# Altium project EEG_tDCS.PrjPcb
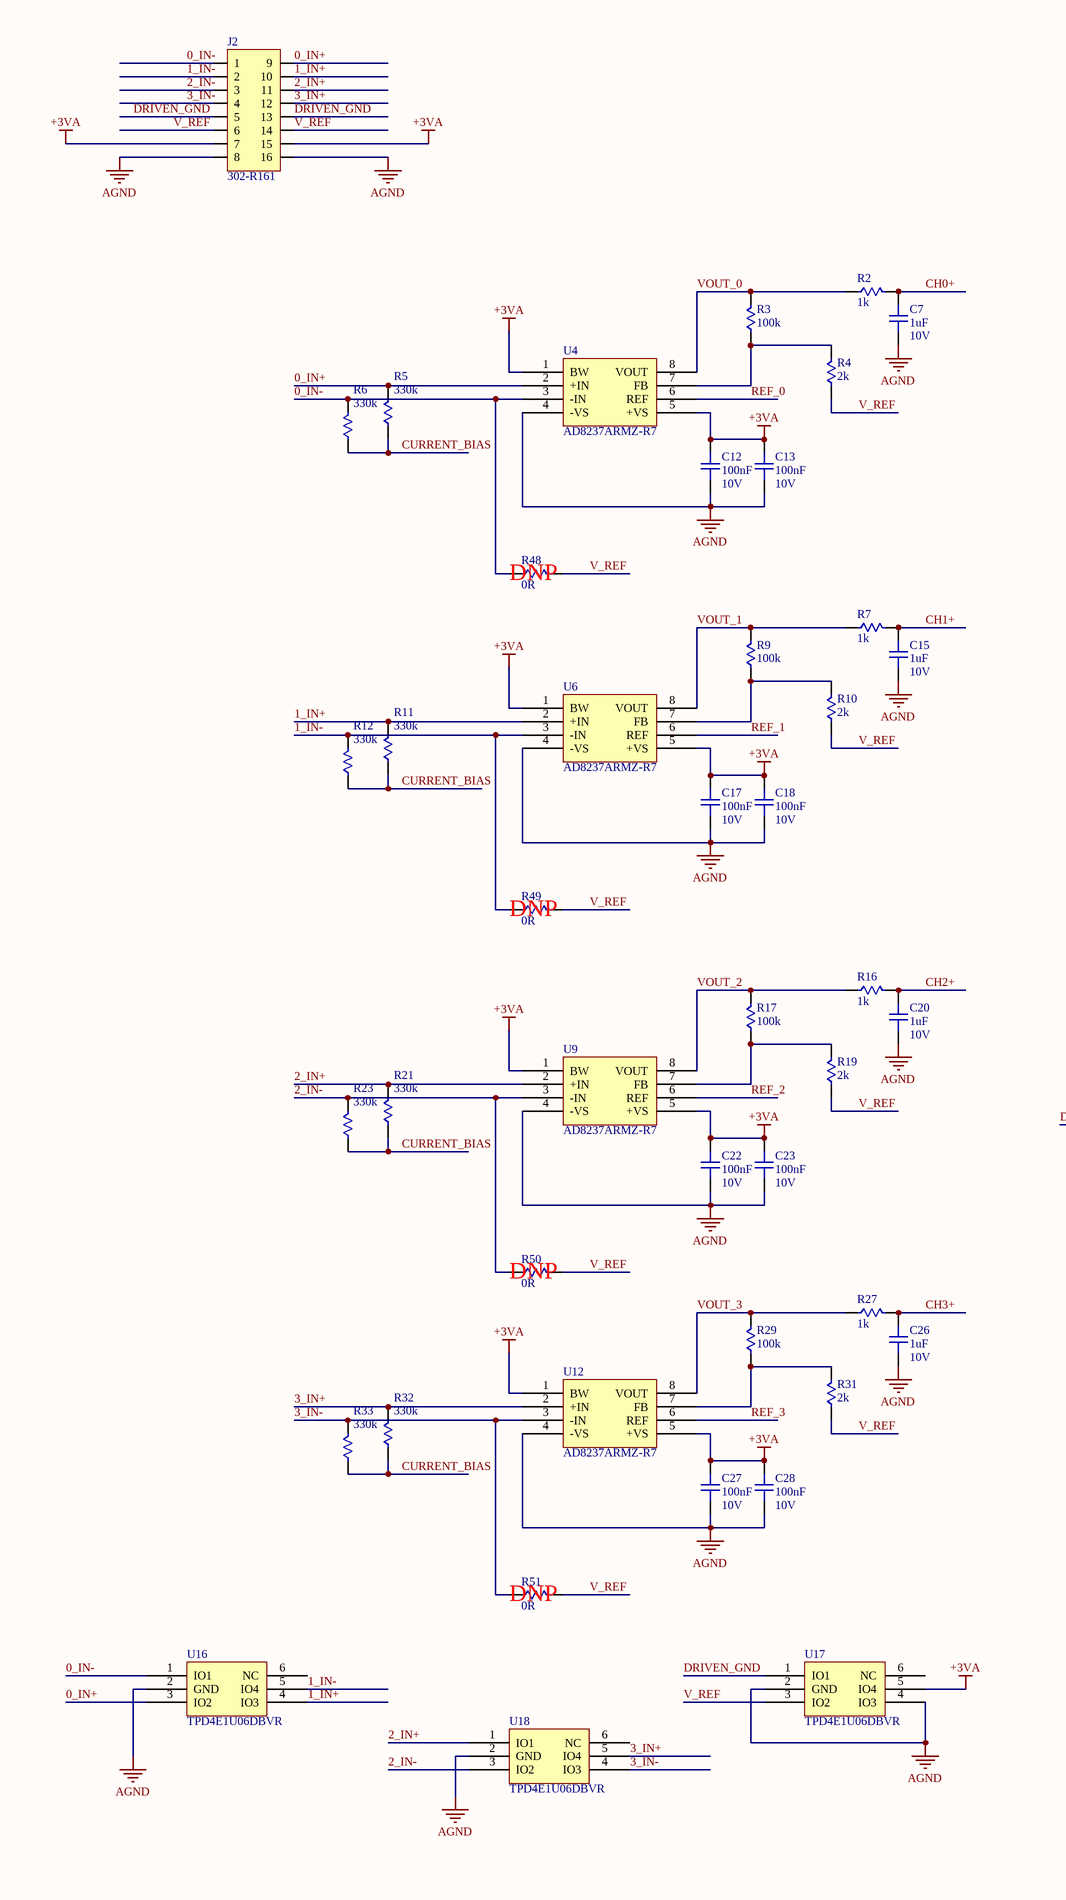
[diagram p0: SENSING.SchDoc, left]
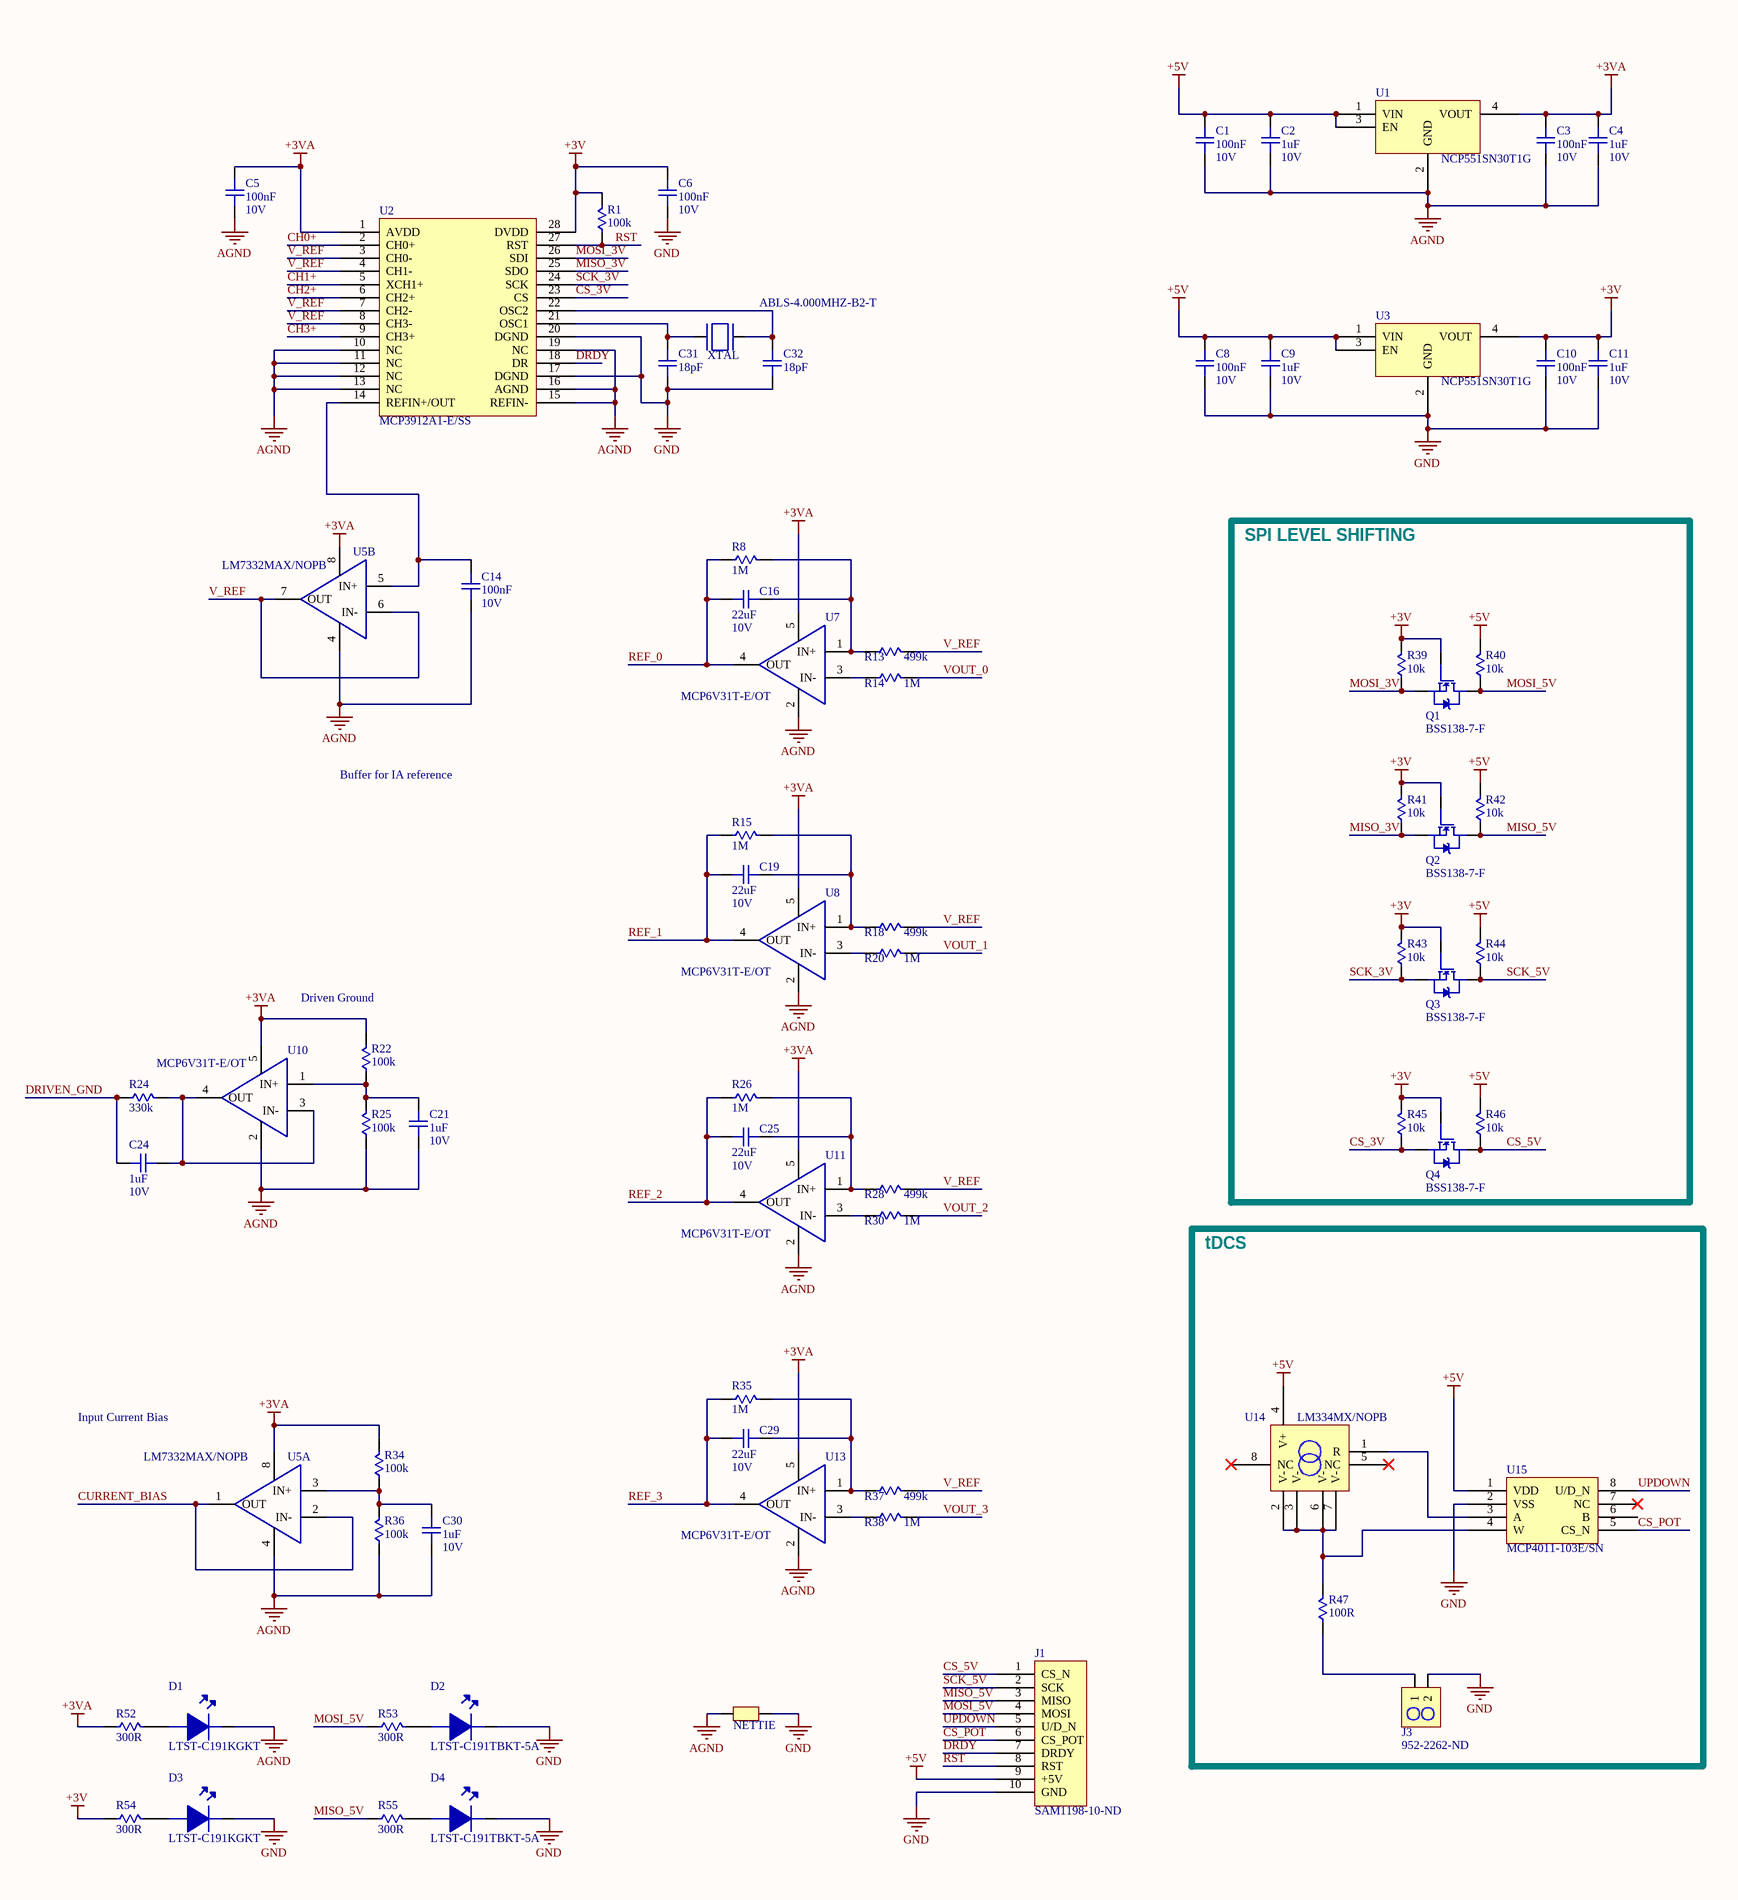
[diagram p1: SENSING.SchDoc, right]
1 sheet, 118 parts. Net scope: global (net labels, ports and power ports of the same name join across sheets).
Board file: EEG_tDCS_PCB.PcbDoc

## Sheet SENSING.SchDoc
size A2

### Parts
C1  100nF  Voltage Rating: 10V  [C0402]
C2  1uF  Voltage Rating: 10V  [C0402]
C3  100nF  Voltage Rating: 10V  [C0402]
C4  1uF  Voltage Rating: 10V  [C0402]
C5  100nF  Voltage Rating: 10V  [C0402]
C6  100nF  Voltage Rating: 10V  [C0402]
C7  1uF  Voltage Rating: 10V  [C0402]
C8  100nF  Voltage Rating: 10V  [C0402]
C9  1uF  Voltage Rating: 10V  [C0402]
C10  100nF  Voltage Rating: 10V  [C0402]
C11  1uF  Voltage Rating: 10V  [C0402]
C12  100nF  Voltage Rating: 10V  [C0402]
C13  100nF  Voltage Rating: 10V  [C0402]
C14  100nF  Voltage Rating: 10V  [C0402]
C15  1uF  Voltage Rating: 10V  [C0402]
C16  22uF  Voltage Rating: 10V  [C0805]
C17  100nF  Voltage Rating: 10V  [C0402]
C18  100nF  Voltage Rating: 10V  [C0402]
C19  22uF  Voltage Rating: 10V  [C0805]
C20  1uF  Voltage Rating: 10V  [C0402]
C21  1uF  Voltage Rating: 10V  [C0402]
C22  100nF  Voltage Rating: 10V  [C0402]
C23  100nF  Voltage Rating: 10V  [C0402]
C24  1uF  Voltage Rating: 10V  [C0402]
C25  22uF  Voltage Rating: 10V  [C0805]
C26  1uF  Voltage Rating: 10V  [C0402]
C27  100nF  Voltage Rating: 10V  [C0402]
C28  100nF  Voltage Rating: 10V  [C0402]
C29  22uF  Voltage Rating: 10V  [C0805]
C30  1uF  Voltage Rating: 10V  [C0402]
C31  18pF  [C0402]
C32  18pF  [C0402]
D1  LTST-C191KGKT  [LED_0603]
D2  LTST-C191TBKT-5A  [LED_0603]
D3  LTST-C191KGKT  [LED_0603]
D4  LTST-C191TBKT-5A  [LED_0603]
J1  SAM1198-10-ND  [Header 10x1 8.5mm]
J2  302-R161  [CONN16POS]
J3  952-2262-ND  [2PIN_HEADER]
Q1  BSS138-7-F  [SOT23-3]
Q2  BSS138-7-F  [SOT23-3]
Q3  BSS138-7-F  [SOT23-3]
Q4  BSS138-7-F  [SOT23-3]
R1  100k  [R0402]
R2  1k  [R0402]
R3  100k  [R0402]
R4  2k  [R0402]
R5  330k  [R0402]
R6  330k  [R0402]
R7  1k  [R0402]
R8  1M  [R0402]
R9  100k  [R0402]
R10  2k  [R0402]
R11  330k  [R0402]
R12  330k  [R0402]
R13  499k  [R0402]
R14  1M  [R0402]
R15  1M  [R0402]
R16  1k  [R0402]
R17  100k  [R0402]
R18  499k  [R0402]
R19  2k  [R0402]
R20  1M  [R0402]
R21  330k  [R0402]
R22  100k  [R0402]
R23  330k  [R0402]
R24  330k  [R0402]
R25  100k  [R0402]
R26  1M  [R0402]
R27  1k  [R0402]
R28  499k  [R0402]
R29  100k  [R0402]
R30  1M  [R0402]
R31  2k  [R0402]
R32  330k  [R0402]
R33  330k  [R0402]
R34  100k  [R0402]
R35  1M  [R0402]
R36  100k  [R0402]
R37  499k  [R0402]
R38  1M  [R0402]
R39  10k  [R0402]
R40  10k  [R0402]
R41  10k  [R0402]
R42  10k  [R0402]
R43  10k  [R0402]
R44  10k  [R0402]
R45  10k  [R0402]
R46  10k  [R0402]
R47  100R  [R0805]
R48  0R  [R0402]
R49  0R  [R0402]
R50  0R  [R0402]
R51  0R  [R0402]
R52  300R  [R0402]
R53  300R  [R0402]
R54  300R  [R0402]
R55  300R  [R0402]
U1  NCP551SN30T1G  [TSOP-5]
U2  MCP3912A1-E/SS  [SSOP-28]
U3  NCP551SN30T1G  [TSOP-5]
U4  AD8237ARMZ-R7  [MSOP-8]
U5  LM7332MAX/NOPB  [8-SOIC]  (parts A,B of 2)
U6  AD8237ARMZ-R7  [MSOP-8]
U7  MCP6V31T-E/OT  [SOT23-5]
U8  MCP6V31T-E/OT  [SOT23-5]
U9  AD8237ARMZ-R7  [MSOP-8]
U10  MCP6V31T-E/OT  [SOT23-5]
U11  MCP6V31T-E/OT  [SOT23-5]
U12  AD8237ARMZ-R7  [MSOP-8]
U13  MCP6V31T-E/OT  [SOT23-5]
U14  LM334MX/NOPB  [8-SOIC]
U15  MCP4011-103E/SN  [8-SOIC]
U16  TPD4E1U06DBVR  [SOT23-6]
U17  TPD4E1U06DBVR  [SOT23-6]
U18  TPD4E1U06DBVR  [SOT23-6]
XTAL  ABLS-4.000MHZ-B2-T  [XTAL]
  NETTIE  [NETTIE]  (net tie, no BOM)

### Blocks framed on the sheet
SPI LEVEL SHIFTING: Q1-Q4 R39-R46
tDCS: J3 R47 U14 U15

### Nets
+3V: C6.2 C10.2 C11.2 Q1.1 Q2.1 Q3.1 Q4.1 R1.2 R39.2 R41.2 R43.2 R45.2 R54.1 U2.28(DVDD) U3.4(VOUT)
+3VA: C3.2 C4.2 C5.2 C12.2 C13.2 C17.2 C18.2 C22.2 C23.2 C27.2 C28.2 J2.7 J2.15 R22.2 R34.2 R52.1 U1.4(VOUT) U2.1(AVDD) U4.1(BW) U4.5(+VS) U5.8(V+) U6.1(BW) U6.5(+VS) U7.5(V+) U8.5(V+) U9.1(BW) U9.5(+VS) U10.5(V+) U11.5(V+) U12.1(BW) U12.5(+VS) U13.5(V+) U17.5(IO4)
+5V: C1.2 C2.2 C8.2 C9.2 J1.9(+5V) R40.2 R42.2 R44.2 R46.2 U1.1(VIN) U1.3(EN) U3.1(VIN) U3.3(EN) U14.4(V+) U15.1(VDD)
AGND: C1.1 C2.1 C3.1 C4.1 C5.1 C7.1 C12.1 C13.1 C14.1 C15.1 C17.1 C18.1 C20.1 C21.1 C22.1 C23.1 C26.1 C27.1 C28.1 C30.1 D1.2 J2.8 J2.16 R25.1 R36.1 U1.2(GND) U2.10(NC) U2.11(NC) U2.12(NC) U2.13(NC) U2.15(REFIN-) U2.16(AGND) U2.19(NC) U4.4(-VS) U5.4(V-) U6.4(-VS) U7.2(V-) U8.2(V-) U9.4(-VS) U10.2(V-) U11.2(V-) U12.4(-VS) U13.2(V-) U16.2(GND) U17.2(GND) U17.4(IO3) U18.2(GND) .1
GND: C6.1 C8.1 C9.1 C10.1 C11.1 C31.1 C32.1 D2.2 D3.2 D4.2 J1.10(GND) J3.2 U2.17(DGND) U2.20(DGND) U3.2(GND) U15.2(VSS) .2
0_IN+: J2.9 R5.2 U4.2(+IN) U16.3(IO2)
0_IN-: J2.1 R6.2 R48.1 U4.3(-IN) U16.1(IO1)
1_IN+: J2.10 R11.2 U6.2(+IN) U16.4(IO3)
1_IN-: J2.2 R12.2 R49.1 U6.3(-IN) U16.5(IO4)
2_IN+: J2.11 R21.2 U9.2(+IN) U18.1(IO1)
2_IN-: J2.3 R23.2 R50.1 U9.3(-IN) U18.3(IO2)
3_IN+: J2.12 R32.2 U12.2(+IN) U18.5(IO4)
3_IN-: J2.4 R33.2 R51.1 U12.3(-IN) U18.4(IO3)
CH0+: C7.2 R2.2 U2.2(CH0+)
CH1+: C15.2 R7.2 U2.5(XCH1+)
CH2+: C20.2 R16.2 U2.6(CH2+)
CH3+: C26.2 R27.2 U2.9(CH3+)
CS_3V: Q4.2 R45.1 U2.23(CS)
CS_5V: J1.1(CS_N) Q4.3 R46.1
CS_POT: J1.6(CS_POT) U15.5(CS_N)
CURRENT_BIAS: R5.1 R6.1 R11.1 R12.1 R21.1 R23.1 R32.1 R33.1 U5.1(OUT) U5.2(IN-)
DRDY: J1.7(DRDY) U2.18(DR)
DRIVEN_GND: C24.2 J2.5 J2.13 R24.1 U17.1(IO1)
MISO_3V: Q2.2 R41.1 U2.25(SDO)
MISO_5V: J1.3(MISO) Q2.3 R42.1 R55.1
MOSI_3V: Q1.2 R39.1 U2.26(SDI)
MOSI_5V: J1.4(MOSI) Q1.3 R40.1 R53.1
REF_0: C16.1 R8.1 U4.6(REF) U7.4(OUT)
REF_1: C19.1 R15.1 U6.6(REF) U8.4(OUT)
REF_2: C25.1 R26.1 U9.6(REF) U11.4(OUT)
REF_3: C29.1 R35.1 U12.6(REF) U13.4(OUT)
RST: J1.8(RST) R1.1 U2.27(RST)
SCK_3V: Q3.2 R43.1 U2.24(SCK)
SCK_5V: J1.2(SCK) Q3.3 R44.1
UPDOWN: J1.5(U/D_N) U15.8(U/D_N)
V_REF: J2.6 J2.14 R4.1 R10.1 R13.2 R18.2 R19.1 R28.2 R31.1 R37.2 R48.2 R49.2 R50.2 R51.2 U2.3(CH0-) U2.4(CH1-) U2.7(CH2-) U2.8(CH3-) U5.6(IN-) U5.7(OUT) U17.3(IO2)
VOUT_0: R2.1 R3.2 R14.2 U4.8(VOUT)
VOUT_1: R7.1 R9.2 R20.2 U6.8(VOUT)
VOUT_2: R16.1 R17.2 R30.2 U9.8(VOUT)
VOUT_3: R27.1 R29.2 R38.2 U12.8(VOUT)
NetC14_2: C14.2 U2.14(REFIN+/OUT) U5.5(IN+)
NetC16_2: C16.2 R8.2 R13.1 U7.1(IN+)
NetC19_2: C19.2 R15.2 R18.1 U8.1(IN+)
NetC21_2: C21.2 R22.1 R25.2 U10.1(IN+)
NetC24_1: C24.1 R24.2 U10.3(IN-) U10.4(OUT)
NetC25_2: C25.2 R26.2 R28.1 U11.1(IN+)
NetC29_2: C29.2 R35.2 R37.1 U13.1(IN+)
NetC30_2: C30.2 R34.1 R36.2 U5.3(IN+)
NetC31_2: C31.2 U2.21(OSC1) XTAL.1
NetC32_2: C32.2 U2.22(OSC2) XTAL.2
NetD1_1: D1.1 R52.2
NetD2_1: D2.1 R53.2
NetD3_1: D3.1 R54.2
NetD4_1: D4.1 R55.2
NetJ3_1: J3.1 R47.1
NetR3_1: R3.1 R4.2 U4.7(FB)
NetR9_1: R9.1 R10.2 U6.7(FB)
NetR14_1: R14.1 U7.3(IN-)
NetR17_1: R17.1 R19.2 U9.7(FB)
NetR20_1: R20.1 U8.3(IN-)
NetR29_1: R29.1 R31.2 U12.7(FB)
NetR30_1: R30.1 U11.3(IN-)
NetR38_1: R38.1 U13.3(IN-)
NetR47_2: R47.2 U14.2(V-) U14.3(V-) U14.6(V-) U14.7(V-) U15.4(W)
NetU14_1: U14.1(R) U15.3(A)

Not connected (* = marked no-connect by the designer): U14 5(NC)* 8(NC)*; U15 6(B) 7(NC)*; U16 6(NC); U17 6(NC); U18 6(NC)

### Notes on the sheet
- (near R48) DNP
- Buffer for IA reference
- (near R49) DNP
- (near R22) Driven Ground
- (near R50) DNP
- Input Current Bias
- (near R51) DNP

### Library data of the parts
C1 C3 C5 C6 C8 C10 C12-C14 C17 C18 C22 C23 C27 C28 = CL05A104MP5NNNC: CAP CER 0.1uF 10V X5R 20% SMD 0402 85C Paper T/R; Manufacturer: Samsung; Supplier 1: Digi-Key; Manufacturer Part Number: CL05A104MP5NNNC; Stock 1: 100000; Pricing 1: 1=0.1, 10=0.024, 100=0.0106, 500=0.0076, 1000=0.006, 2500=0.0054, 5000=0.005 (USD); Mount: Surface Mount; Case/Package: 0402; Case Code (Metric): 1005; Case Code (Imperial): 0402; Min Operating Temperature: -55°C; Max Operating Temperature: 85°C; Packaging: Tape and Reel; Capacitance: 100nF; Tolerance: 20%; Dielectric: X5R; Voltage Rating (DC): 10V; Length: 1mm; Height: 0.5mm; Width: 0.02inch; Thickness: 0.022inch; Depth: 0.5mm; Radiation Hardening: No; Lead Free: Lead Free; ComponentLink1URL: https://media.digikey.com/pdf/Data%20Sheets/Samsung%20PDFs/CL_Series_MLCC_ds.pdf; ComponentLink1Description: https://media.digikey.com/pdf/Data%20Sheets/Samsung%20PDFs/CL_Series_MLCC_ds.pdf; Supplier Part Number 1: 1276-1443-1-ND
C2 C4 C7 C9 C11 C15 C20 C21 C24 C26 C30 = CL05A105MP5NNNC: CAP CER 1uF 10V X5R 20% SMD 0402 85C Paper T/R; Manufacturer: Samsung; Supplier 1: Digi-Key; Manufacturer Part Number: CL05A105MP5NNNC; Stock 1: 51298; Pricing 1: 1=0.1, 10=0.031, 100=0.014, 500=0.01, 1000=0.0079, 2500=0.0072, 5000=0.0066 (USD); Mount: Surface Mount; Case/Package: 0402; Case Code (Metric): 1005; Case Code (Imperial): 0402; Min Operating Temperature: -55°C; Max Operating Temperature: 85°C; Package Quantity: 1; Packaging: Tape and Reel; Capacitance: 1uF; Tolerance: 20%; Dielectric: X5R; Voltage Rating (DC): 10V; Length: 1mm; Height: 0.5mm; Width: 0.02inch; Thickness: 0.022inch; Depth: 0.5mm; Radiation Hardening: No; Lead Free: Lead Free; ComponentLink1URL: https://media.digikey.com/pdf/Data%20Sheets/Samsung%20PDFs/CL_Series_MLCC_ds.pdf; ComponentLink1Description: https://media.digikey.com/pdf/Data%20Sheets/Samsung%20PDFs/CL_Series_MLCC_ds.pdf; Supplier Part Number 1: 1276-1448-1-ND
C16 C19 C25 C29 = CL21A226KPCLRNC: CAP CER 22uF 10V X5R 10% SMD 0805 85C Cardboard T/R; Manufacturer: Samsung; Supplier 1: Digi-Key; Manufacturer Part Number: CL21A226KPCLRNC; Stock 1: 40000; Pricing 1: 1=0.38, 10=0.26, 100=0.1471, 500=0.1039, 1000=0.0909 (USD); Mount: Surface Mount; Case/Package: 0805; Case Code (Metric): 2012; Case Code (Imperial): 0805; Min Operating Temperature: -55°C; Max Operating Temperature: 85°C; Packaging: Tape and Reel; Tolerance: 10%; Capacitance: 22uF; Dielectric: X5R; Length: 2mm; Width: 0.049inch; Thickness: 0.037inch; Depth: 1.25mm; Radiation Hardening: No; Lead Free: Lead Free; ComponentLink1URL: https://www.verical.com/server-webapp/html/getDatasheet?partID=781772; ComponentLink1Description: https://www.verical.com/server-webapp/html/getDatasheet?partID=781772; Supplier Part Number 1: 1276-6786-1-ND
C31 C32 = CL05C180JB5NNNC: CAP CER 18pF 50V C0G 5% SMD 0402 125C Paper T/R; Manufacturer: Samsung; Material: Ceramic; Temperature Coefficient: 300ppm/°C; Supplier 1: Digi-Key; Manufacturer Part Number: CL05C180JB5NNNC; Stock 1: 42154; Pricing 1: 1=0.1, 10=0.033, 100=0.0148, 500=0.0105, 1000=0.0083, 2500=0.0075, 5000=0.0069 (USD); Mount: Surface Mount; Case/Package: 0402; Case Code (Metric): 1005; Case Code (Imperial): 0402; Contact Plating: Tin; Min Operating Temperature: -55°C; Max Operating Temperature: 125°C; Package Quantity: 1; Packaging: Tape and Reel; Capacitance: 18pF; Tolerance: 5%; Voltage Rating: 50V; Dielectric: C0G; Voltage: 50V; Length: 1mm; Height: 0.5mm; Width: 0.02inch; Thickness: 0.022inch; Depth: 0.5mm; Radiation Hardening: No; ComponentLink1URL: https://www.verical.com/server-webapp/html/getDatasheet?partID=482699; ComponentLink1Description: https://www.verical.com/server-webapp/html/getDatasheet?partID=482699; ComponentLink2URL: https://www.distrelec.biz/Web/Downloads/_e/ng/MLCC_CatalogDownload2013_ENG.pdf?mime=application%2Fpdf; ComponentLink2Description: https://www.distrelec.biz/Web/Downloads/_e/ng/MLCC_CatalogDownload2013_ENG.pdf?mime=application%2Fpdf; ComponentLink3URL: https://produktinfo.conrad.com/datenblaetter/450000-474999/458675-da-01-en-VS_KONDENSATOR_0402.pdf; ComponentLink3Description: https://produktinfo.conrad.com/datenblaetter/450000-474999/458675-da-01-en-VS_KONDENSATOR_0402.pdf; Supplier Part Number 1: 1276-1140-1-ND
D1 D3 = LTST-C191KGKT: LED GREEN CLEAR 0603 SMD; Manufacturer: Vishay Lite-On; Lens Colour: Clear,Colorless; Power Rating: 75mW; Luminous Intensity: 35mcd; Viewing Angle: 130°; Lens Style: Clear,Diffused,Colorless,Rectangular; Forward Current: 30mA; Forward Voltage: 2V; Dominant Wavelength: 571nm; Test Current: 20mA; Number of Elements: 1; Wavelength: 574nm; Supplier 1: Digi-Key; Manufacturer Part Number: LTST-C191KGKT; Stock 1: 1301664; Pricing 1: 1=0.29, 10=0.211, 25=0.1556, 100=0.1111, 250=0.0756, 500=0.0667, 1000=0.0522, 2500=0.0511 (USD); Mount: Surface Mount; Case/Package: 0603; Number of Pins: 2; Colour: Green; Case Code (Metric): 1608; Case Code (Imperial): 0603; Min Operating Temperature: -55°C; Max Operating Temperature: 85°C; Packaging: Tape and Reel; Package Quantity: 1; Illumination Colour: Green; Lens Transparency: Clear; Power Dissipation: 75mW; Number of LEDs: 1; Length: 1.6mm; Height: 0.55mm; Width: 0.8mm; Depth: 0.8mm; Radiation Hardening: No; Lead Free: Lead Free; ComponentLink1URL: https://datasheet.ciiva.com/12400/100-ltst-c191kgkt-53586-12400818.pdf; ComponentLink1Description: https://datasheet.ciiva.com/12400/100-ltst-c191kgkt-53586-12400818.pdf; ComponentLink2URL: https://datasheet.ciiva.com/2109/s-110-ltst-c191kgkt-2109973.pdf; ComponentLink2Description: https://datasheet.ciiva.com/2109/s-110-ltst-c191kgkt-2109973.pdf; ComponentLink3URL: https://datasheet.ciiva.com/2109/s-110-ltst-c191kgkt-2109974.pdf; ComponentLink3Description: https://datasheet.ciiva.com/2109/s-110-ltst-c191kgkt-2109974.pdf; ComponentLink4URL: https://datasheet.ciiva.com/2109/s-110-ltst-c191kgkt-2109975.pdf; ComponentLink4Description: https://datasheet.ciiva.com/2109/s-110-ltst-c191kgkt-2109975.pdf; ComponentLink5URL: https://datasheet.ciiva.com/15223/getdatasheetpartid-103913-15223276.pdf; ComponentLink5Description: https://datasheet.ciiva.com/15223/getdatasheetpartid-103913-15223276.pdf; ComponentLink6URL: https://datasheet.ciiva.com/11773/0900766b80dc02b1-11773629.pdf; ComponentLink6Description: https://datasheet.ciiva.com/11773/0900766b80dc02b1-11773629.pdf; ComponentLink7URL: https://datasheet.ciiva.com/16215/ltst-c191kgkt-16215151.pdf; ComponentLink7Description: https://datasheet.ciiva.com/16215/ltst-c191kgkt-16215151.pdf; Supplier Part Number 1: 160-1446-6-ND
D2 D4 = LTST-C191TBKT-5A: LED BLUE CLEAR 0603 SMD; Manufacturer: Vishay Lite-On; Lens Colour: Colorless; Lens Style: Diffused,Colorless,Rectangular; Viewing Angle: 130°; Forward Current: 20mA; Forward Voltage: 2.8V; Luminous Intensity: 15mcd; Test Current: 5mA; Dominant Wavelength: 473nm; Number of LEDs: 1; Voltage: 29V; Supplier 1: Digi-Key; Manufacturer Part Number: LTST-C191TBKT-5A; Stock 1: 2918; Pricing 1: 1=0.52, 10=0.376, 25=0.2884, 100=0.1881, 250=0.138, 500=0.117, 1000=0.0961, 2500=0.0836 (USD); Mount: Surface Mount; Case/Package: 0603; Colour: Blue; Case Code (Metric): 1608; Case Code (Imperial): 0603; Min Operating Temperature: -20°C; Max Operating Temperature: 80°C; Packaging: Tape and Reel; Package Quantity: 5000; Illumination Colour: Blue; Lens Transparency: Clear; Length: 1.6mm; Height: 0.55mm; Width: 0.8mm; Radiation Hardening: No; ComponentLink1URL: http://components.arrow.com/part/dataview/52218576S9813001N1331; ComponentLink1Description: http://components.arrow.com/part/dataview/52218576S9813001N1331; ComponentLink2URL: http://optoelectronics.liteon.com/zh-cn/api/DwonloadFileHandler.ashx?txtSpecNo=DS22-2003-020&txtPartNo=LTST-C191TBKT-5A; ComponentLink2Description: http://optoelectronics.liteon.com/zh-cn/api/DwonloadFileHandler.ashx?txtSpecNo=DS22-2003-020&txtPartNo=LTST-C191TBKT-5A; Supplier Part Number 1: 160-2212-6-ND
J1 = CONN_10pin: 10 pin header connector; Supplier 1: Arrow; Supplier 2: Arrow; Supplier 3: Digi-Key; Supplier Part Number 1: 2698789; Supplier Part Number 2: 2698803S4475693N1004; Supplier Part Number 3: SAM1198-10-ND
J2 = 302-R161: 16 Positions Header, Shrouded Connector 0.100" (2.54mm) Through Hole, Right Angle Gold; Manufacturer: On-Shore Technology; Number of Positions: 16; Connector Type: Male Pin; Pitch: 0.1inch; Supplier 1: Digi-Key; Manufacturer Part Number: 302-R161; Stock 1: 7509; Pricing 1: 1=0.44, 10=0.417, 180=0.3197, 540=0.278, 1080=0.2294, 5040=0.2016, 10080=0.1877 (USD); Mount: Through Hole; Colour: Black; Contact Plating: Gold; Number of Rows: 2; Packaging: Tray; Termination: Solder; Row Spacing: 0.1inch; ComponentLink1URL: http://www.on-shore.com/wp-content/uploads/2015/09/302-rxxx.pdf; ComponentLink1Description: http://www.on-shore.com/wp-content/uploads/2015/09/302-rxxx.pdf; Supplier Part Number 1: ED10535-ND
J3 = M20-9990246: CONN_HeaderPins2pos Headers & Wire Housings 02 SIL VERTICAL PIN HEADER TIN; Manufacturer: Harwin; Contact Resistance: 30mR; Max Current Rating: 3A; Number of Positions: 2; Gender: Male; Connector Type: Male Pin; Insulation Resistance: 10GR; Voltage Rating (AC): 750V; Pitch: 2.54mm; Supplier 1: Digi-Key; Manufacturer Part Number: M20-9990246; Stock 1: 53577; Pricing 1: 1=0.11, 10=0.099, 100=0.0609, 500=0.0504, 1000=0.0441, 5000=0.0378, 10000=0.0368 (USD); Case/Package: SIL; Colour: Black; Housing Colour: Black; Housing Material: Nylon; Contact Plating: Tin; Contact Material: Bronze,Brass; Min Operating Temperature: -40°C; Max Operating Temperature: 105°C; Package Quantity: 1000; Packaging: Bulk; Termination: Solder; Number of Rows: 1; Number of Contacts: 2; Orientation: Straight; Current Rating: 3A; Length: 5.08mm; Depth: 2.54mm; Contact Mating Length: 0.24inch; Radiation Hardening: No; REACH SVHC: No SVHC; ComponentLink1URL: https://datasheet.ciiva.com/8046/315376-8046930.pdf; ComponentLink1Description: https://datasheet.ciiva.com/8046/315376-8046930.pdf; ComponentLink2URL: https://datasheet.ciiva.com/6833/m20-999-6833368.pdf; ComponentLink2Description: https://datasheet.ciiva.com/6833/m20-999-6833368.pdf; ComponentLink3URL: https://datasheet.ciiva.com/11745/0900766b81034e61-11745755.pdf; ComponentLink3Description: https://datasheet.ciiva.com/11745/0900766b81034e61-11745755.pdf; ComponentLink4URL: https://datasheet.ciiva.com/22660/1830818-22660571.pdf; ComponentLink4Description: https://datasheet.ciiva.com/22660/1830818-22660571.pdf; ComponentLink5URL: https://datasheet.ciiva.com/26852/getdatasheetpartid-384170-26852203.pdf; ComponentLink5Description: https://datasheet.ciiva.com/26852/getdatasheetpartid-384170-26852203.pdf; Supplier Part Number 1: 952-2262-ND
Q1-Q4 = BSS138-7-F: MOSFET N-CH 50V 200MA SOT23-3; Manufacturer: Diodes; Nominal Vgs: 1.2V; Rds On Max: 3.5R; Input Capacitance: 50pF; Number of Elements: 1; Max Power Dissipation: 300mW; Turn-Off Delay Time: 20ns; Element Configuration: Single; Gate to Source Voltage (Vgs): 20V; Fall Time: 25ns; Rise Time: 10ns; Current: 2A; Supplier 1: Digi-Key; Manufacturer Part Number: BSS138-7-F; Stock 1: 6200; Pricing 1: 1=0.23, 10=0.212, 100=0.119, 500=0.0637, 1000=0.0433 (USD); Mount: Surface Mount; Case/Package: SOT-23; Number of Pins: 3; Weight: 0.000282oz; Contact Plating: Matte,Tin; Min Operating Temperature: -55°C; Max Operating Temperature: 150°C; Packaging: Tape and Reel; Package Quantity: 3000; Drain to Source Voltage (Vdss): 50V; Continuous Drain Current (ID): 200mA; Drain to Source Breakdown Voltage: 50V; Drain to Source Resistance: 3.5R; Power Dissipation: 300mW; Turn-On Delay Time: 20ns; Threshold Voltage: 1.2V; Number of Channels: 1; Voltage Rating (DC): 50V; Current Rating: 200mA; Voltage: 50V; On-State Resistance: 3.5R; Length: 2.9mm; Height: 1mm; Width: 1.3mm; REACH SVHC: No SVHC; Lead Free: Lead Free; ComponentLink1URL: http://www.diodes.com/datasheets/BSS138.pdf; ComponentLink1Description: http://www.diodes.com/datasheets/BSS138.pdf; ComponentLink2URL: http://www.farnell.com/datasheets/1915619.pdf; ComponentLink2Description: http://www.farnell.com/datasheets/1915619.pdf; ComponentLink3URL: https://www.diodes.com/assets/Datasheets/ds30144.pdf; ComponentLink3Description: https://www.diodes.com/assets/Datasheets/ds30144.pdf; ComponentLink4URL: http://www.diodes.com/_files/datasheets/ds30144.pdf; ComponentLink4Description: http://www.diodes.com/_files/datasheets/ds30144.pdf; Supplier Part Number 1: BSS138-FDICT-ND
R1 R3 R9 R17 R22 R25 R29 R34 R36 = RC0402FR-07100KL: RES SMD 100K OHM 1% 1/16W 0402; Manufacturer: Yageo; Resistance: 100kR; Temperature Coefficient: 100ppm/°C; Power Rating: 63mW; Voltage Rating: 50V; Supplier 1: Digi-Key; Manufacturer Part Number: RC0402FR-07100KL; Stock 1: 16311362; Pricing 1: 1=0.1, 10=0.018, 100=0.0073, 1000=0.0033, 2500=0.0029, 5000=0.0024 (USD); Case/Package: 0402; Case Code (Metric): 1005; Case Code (Imperial): 0402; Min Operating Temperature: -55°C; Max Operating Temperature: 155°C; Tolerance: 1%; Packaging: Tape and Reel; Composition: Thick Film; Termination: SMD/SMT; Military Standard: Not; Number of Terminations: 2; Working Voltage: 50V; Package Quantity: 1; Max Power Dissipation: 63mW; Features: Moisture Resistant; Length: 0.039inch; Height: 0.016inch; Width: 0.02inch; Depth: 0.5mm; REACH SVHC: No SVHC; Lead Free: Lead Free; ComponentLink1URL: http://www.yageo.com/documents/recent/PYu-RC_Group_51_RoHS_L_9.pdf; ComponentLink1Description: http://www.yageo.com/documents/recent/PYu-RC_Group_51_RoHS_L_9.pdf; ComponentLink2URL: http://www.farnell.com/datasheets/1018594.pdf; ComponentLink2Description: http://www.farnell.com/datasheets/1018594.pdf; ComponentLink3URL: http://www.yageo.com/documents/recent/PYu-RC_Group_51_RoHS_L_8.pdf; ComponentLink3Description: http://www.yageo.com/documents/recent/PYu-RC_Group_51_RoHS_L_8.pdf; ComponentLink4URL: http://documents.rs-components.com/techlib://itc_doclist_GB.htm?stockno=6185797; ComponentLink4Description: http://documents.rs-components.com/techlib://itc_doclist_GB.htm?stockno=6185797; Supplier Part Number 1: 311-100KLRCT-ND
R2 R7 R16 R27 = RC0402FR-071KL: RES SMD 1K OHM 1% 1/16W 0402; Manufacturer: Yageo; Resistance: 1kR; Temperature Coefficient: 100ppm/°C; Power Rating: 62.5mW; Voltage Rating (DC): 50V; Supplier 1: Digi-Key; Manufacturer Part Number: RC0402FR-071KL; Stock 1: 121806164; Pricing 1: 1=0.1, 10=0.018, 100=0.0073, 1000=0.0033, 2500=0.0029, 5000=0.0024 (USD); Case/Package: 0402; Number of Pins: 2; Case Code (Imperial): 0402; Case Code (Metric): 1005; Min Operating Temperature: -55°C; Max Operating Temperature: 155°C; Tolerance: 1%; Packaging: Tape and Reel; Composition: Thick Film; Voltage Rating: 50V; Termination: SMD/SMT; Military Standard: Not; Length: 1mm; Height: 0.32mm; Width: 0.5mm; Depth: 0.5mm; REACH SVHC: Unknown; Lead Free: Lead Free; ComponentLink1URL: http://documents.rs-components.com/techlib://itc_doclist_GB.htm?stockno=6186122; ComponentLink1Description: http://documents.rs-components.com/techlib://itc_doclist_GB.htm?stockno=6186122; ComponentLink2URL: http://www.mouser.com/ds/2/447/PYu-RC0402_51_RoHS_L_6_r-8721.pdf; ComponentLink2Description: http://www.mouser.com/ds/2/447/PYu-RC0402_51_RoHS_L_6_r-8721.pdf; ComponentLink3URL: http://www.yageo.com/documents/recent/PYu-RC0402_51_RoHS_L_6_r.pdf; ComponentLink3Description: http://www.yageo.com/documents/recent/PYu-RC0402_51_RoHS_L_6_r.pdf; ComponentLink4URL: http://www.farnell.com/datasheets/1018594.pdf; ComponentLink4Description: http://www.farnell.com/datasheets/1018594.pdf; Supplier Part Number 1: 311-1.00KLRCT-ND
R4 R10 R19 R31 = RC0402FR-072KL: RES SMD 2K OHM 1% 1/16W 0402; Manufacturer: Yageo; Resistance: 2kR; Power Rating: 63mW; Voltage Rating: 50V; Temperature Coefficient: 100ppm/°C; Supplier 1: Digi-Key; Manufacturer Part Number: RC0402FR-072KL; Stock 1: 11965319; Pricing 1: 1=0.1, 10=0.018, 100=0.0073, 1000=0.0033, 2500=0.0029, 5000=0.0024 (USD); Case/Package: 0402; Case Code (Metric): 1005; Case Code (Imperial): 0402; Min Operating Temperature: -55°C; Max Operating Temperature: 155°C; Tolerance: 1%; Package Quantity: 1; Packaging: Tape and Reel; Composition: Thick Film; Number of Terminations: 2; Termination: SMD/SMT; Military Standard: Not; Max Power Dissipation: 63mW; Voltage Rating (DC): 50V; Working Voltage: 50V; Features: Moisture Resistant; Length: 1mm; Height: 0.016inch; Width: 0.02inch; Depth: 0.5mm; REACH SVHC: Unknown; Lead Free: Lead Free; ComponentLink1URL: http://www.yageo.com/documents/recent/PYu-RC_Group_51_RoHS_L_9.pdf; ComponentLink1Description: http://www.yageo.com/documents/recent/PYu-RC_Group_51_RoHS_L_9.pdf; ComponentLink2URL: http://documents.rs-components.com/techlib://itc_doclist_GB.htm?stockno=6186510; ComponentLink2Description: http://documents.rs-components.com/techlib://itc_doclist_GB.htm?stockno=6186510; ComponentLink3URL: https://www.verical.com/server-webapp/html/getDatasheet?partID=358921; ComponentLink3Description: https://www.verical.com/server-webapp/html/getDatasheet?partID=358921; ComponentLink4URL: http://www.mouser.com/ds/2/447/PYu-RC0402_51_RoHS_L_6_r-8721.pdf; ComponentLink4Description: http://www.mouser.com/ds/2/447/PYu-RC0402_51_RoHS_L_6_r-8721.pdf; ComponentLink5URL: http://www.farnell.com/datasheets/1018594.pdf; ComponentLink5Description: http://www.farnell.com/datasheets/1018594.pdf; ComponentLink6URL: http://www.farnell.com/datasheets/2167052.pdf; ComponentLink6Description: http://www.farnell.com/datasheets/2167052.pdf; Supplier Part Number 1: 311-2KLRCT-ND
R5 R6 R11 R12 R21 R23 R24 R32 R33 = RC0402FR-07330KL: RES SMD 330K OHM 1% 1/16W 0402; Manufacturer: Yageo; Resistance: 330kR; Power Rating: 63mW; Voltage Rating: 50V; Temperature Coefficient: 100ppm/°C; Supplier 1: Digi-Key; Manufacturer Part Number: RC0402FR-07330KL; Stock 1: 1854774; Pricing 1: 1=0.1, 10=0.018, 100=0.0073, 1000=0.0033, 2500=0.0029, 5000=0.0024 (USD); Case/Package: 0402; Case Code (Metric): 1005; Case Code (Imperial): 0402; Min Operating Temperature: -55°C; Max Operating Temperature: 155°C; Package Quantity: 1; Tolerance: 1%; Packaging: Tape and Reel; Composition: Thick Film; Number of Terminations: 2; Termination: SMD/SMT; Military Standard: Not; Max Power Dissipation: 63mW; Features: Moisture Resistant; Length: 1mm; Height: 0.016inch; Width: 0.02inch; Depth: 0.5mm; REACH SVHC: Unknown; Lead Free: Lead Free; ComponentLink1URL: http://www.yageo.com/documents/recent/PYu-RC_Group_51_RoHS_L_9.pdf; ComponentLink1Description: http://www.yageo.com/documents/recent/PYu-RC_Group_51_RoHS_L_9.pdf; ComponentLink2URL: http://www.mouser.com/ds/2/447/PYu-RC0402_51_RoHS_L_6_r-8721.pdf; ComponentLink2Description: http://www.mouser.com/ds/2/447/PYu-RC0402_51_RoHS_L_6_r-8721.pdf; ComponentLink3URL: http://www.farnell.com/datasheets/1018594.pdf; ComponentLink3Description: http://www.farnell.com/datasheets/1018594.pdf; ComponentLink4URL: http://www.yageo.com/documents/recent/PYu-RC0402_51_RoHS_L_6_r.pdf; ComponentLink4Description: http://www.yageo.com/documents/recent/PYu-RC0402_51_RoHS_L_6_r.pdf; Supplier Part Number 1: 311-330KLRCT-ND
R8 R14 R15 R20 R26 R30 R35 R38 = RC0402FR-071ML: RES SMD 1M OHM 1% 1/16W 0402; Manufacturer: Yageo; Resistance: 1MR; Power Rating: 63mW; Voltage Rating: 50V; Temperature Coefficient: 100ppm/°C; Supplier 1: Digi-Key; Manufacturer Part Number: RC0402FR-071ML; Stock 1: 18919667; Pricing 1: 1=0.1, 10=0.018, 100=0.0073, 1000=0.0033, 2500=0.0029, 5000=0.0024 (USD); Case/Package: 0402; Case Code (Imperial): 0402; Case Code (Metric): 1005; Min Operating Temperature: -55°C; Max Operating Temperature: 155°C; Packaging: Tape and Reel; Tolerance: 1%; Termination: SMD/SMT; Composition: Thick Film; Military Standard: Not; Length: 1mm; Height: 0.32mm; Depth: 0.5mm; REACH SVHC: Unknown; Lead Free: Lead Free; ComponentLink1URL: http://www.farnell.com/datasheets/1018594.pdf; ComponentLink1Description: http://www.farnell.com/datasheets/1018594.pdf; ComponentLink2URL: http://www.yageo.com/documents/recent/PYu-RC0402_51_RoHS_L_6_r.pdf; ComponentLink2Description: http://www.yageo.com/documents/recent/PYu-RC0402_51_RoHS_L_6_r.pdf; Supplier Part Number 1: 311-1.00MLRCT-ND
R13 R18 R28 R37 = RMCF0402FT499K: RES SMD 499K 0402 1% 1/16W 100ppm/C Molded SMD Paper T/R; Manufacturer: Stackpole Electronics; Resistance: 499kR; Max Power Dissipation: 63mW; Temperature Coefficient: 100ppm/°C; Supplier 1: Digi-Key; Manufacturer Part Number: RMCF0402FT499K; Stock 1: 80000; Pricing 1: 1=0.1, 10=0.016, 100=0.0064, 1000=0.0029, 2500=0.0025, 5000=0.0021 (USD); Mount: Surface Mount; Case/Package: 0402; Case Code (Metric): 1005; Case Code (Imperial): 0402; Contact Plating: Matte,Tin; Min Operating Temperature: -55°C; Max Operating Temperature: 155°C; Package Quantity: 10000; Packaging: Tape and Reel; Tolerance: 1%; Composition: Thick Film; Number of Terminations: 2; Features: Automotive AEC-Q200; Length: 0.039inch; Height: 0.016inch; Width: 0.02inch; Lead Free: Lead Free; Supplier Part Number 1: RMCF0402FT499KCT-ND
R39-R46 = RC0402JR-0710KL: RES SMD 10K OHM 5% 1/16W 0402; Manufacturer: Yageo; Resistance: 10kR; Power Rating: 62.5mW; Voltage Rating: 50V; Temperature Coefficient: 100ppm/°C; Max Power Dissipation: 63mW; Supplier 1: Digi-Key; Manufacturer Part Number: RC0402JR-0710KL; Stock 1: 47303622; Pricing 1: 1=0.1, 10=0.018, 100=0.0073, 1000=0.0033, 2500=0.0029, 5000=0.0024 (USD); Case/Package: 0402; Case Code (Metric): 1005; Case Code (Imperial): 0402; Min Operating Temperature: -55°C; Max Operating Temperature: 155°C; Packaging: Tape and Reel; Tolerance: 5%; Package Quantity: 1; Composition: Thick Film; Number of Terminations: 2; Termination: SMD/SMT; Military Standard: Not; Features: Moisture Resistant; Length: 1mm; Height: 0.016inch; Width: 0.02inch; Depth: 0.5mm; REACH SVHC: Unknown; Lead Free: Lead Free; Supplier Part Number 1: 311-10KJRCT-ND
R47 = RC0805FR-07100RL: RES SMD 100 OHM 1% 1/8W 0805; Manufacturer: Yageo; Power Rating: 125mW; Voltage Rating: 150V; Temperature Coefficient: 100ppm/°C; Supplier 1: Digi-Key; Manufacturer Part Number: RC0805FR-07100RL; Stock 1: 12008452; Pricing 1: 1=0.1, 10=0.046, 100=0.0186, 1000=0.0084, 2500=0.0073 (USD); Case/Package: 0805; Number of Pins: 2; Case Code (Imperial): 0805; Case Code (Metric): 2012; Min Operating Temperature: -55°C; Max Operating Temperature: 155°C; Resistance: 100R; Tolerance: 1%; Packaging: Tape and Reel; Package Quantity: 1; Termination: SMD/SMT; Composition: Thick Film; Number of Terminations: 2; Max Power Dissipation: 125mW; Features: Moisture Resistant; Voltage Rating (DC): 150V; Military Standard: Not; Length: 2mm; Height: 0.024inch; Width: 0.049inch; Depth: 1.25mm; Lead Pitch: 0.4mm; REACH SVHC: Unknown; Lead Free: Lead Free; ComponentLink1URL: http://www.farnell.com/datasheets/1697719.pdf; ComponentLink1Description: http://www.farnell.com/datasheets/1697719.pdf; ComponentLink2URL: http://www.yageo.ru/pdf/RC0805.pdf; ComponentLink2Description: http://www.yageo.ru/pdf/RC0805.pdf; ComponentLink3URL: http://www.farnell.com/datasheets/444164.pdf; ComponentLink3Description: http://www.farnell.com/datasheets/444164.pdf; ComponentLink4URL: http://www.yageo.com/documents/recent/PYu-RC_Group_51_RoHS_L_9.pdf; ComponentLink4Description: http://www.yageo.com/documents/recent/PYu-RC_Group_51_RoHS_L_9.pdf; ComponentLink5URL: http://www.farnell.com/datasheets/38627.pdf; ComponentLink5Description: http://www.farnell.com/datasheets/38627.pdf; ComponentLink6URL: http://www.farnell.com/datasheets/1686128.pdf; ComponentLink6Description: http://www.farnell.com/datasheets/1686128.pdf; Supplier Part Number 1: 311-100CRCT-ND
R48-R51 = RC0402JR-070RL: RES SMD 0 OHM 1/16W 0402; Manufacturer: Yageo; Resistance: 0mR; Power Rating: 62.5mW; Tolerance: 5%; Voltage Rating: 50V; Max Power Dissipation: 63mW; Temperature Coefficient: 200ppm/°C; Supplier 1: Digi-Key; Manufacturer Part Number: RC0402JR-070RL; Stock 1: 44333412; Pricing 1: 1=0.1, 10=0.017, 25=0.0124, 50=0.0096, 100=0.007, 250=0.0054, 500=0.0043, 1000=0.0032, 5000=0.0023 (USD); Case/Package: 0402; Contact Plating: Matte,Tin; Case Code (Metric): 1005; Case Code (Imperial): 0402; Min Operating Temperature: -55°C; Max Operating Temperature: 155°C; Packaging: Tape and Reel; Composition: Thick Film; Package Quantity: 1; Number of Terminations: 2; Termination: SMD/SMT; Military Standard: Not; Features: Moisture Resistant; Length: 1mm; Height: 0.016inch; Width: 0.02inch; Depth: 0.5mm; Radiation Hardening: No; REACH SVHC: Unknown; Lead Free: Lead Free; Supplier Part Number 1: 311-0.0JRCT-ND
R52-R55 = ERJ-2RKF3000X: RES SMD 300R 0402 300 Ohm 1% 1/10W ±100ppm/C Molded SMD Punched Carrier T/R; Manufacturer: Panasonic; Power Rating: 100mW; Voltage Rating: 50V; Temperature Coefficient: 100ppm/°C; Supplier 1: Digi-Key; Manufacturer Part Number: ERJ-2RKF3000X; Stock 1: 2431619; Pricing 1: 1=0.1, 10=0.054, 100=0.0221, 1000=0.0099, 2500=0.0086, 5000=0.0071 (USD); Mount: Surface Mount; Case/Package: 0402; Case Code (Metric): 1005; Case Code (Imperial): 0402; Contact Plating: Tin; Min Operating Temperature: -55°C; Max Operating Temperature: 155°C; Resistance: 300R; Tolerance: 1%; Packaging: Tape and Reel; Package Quantity: 10000; Composition: Thick Film; Number of Terminations: 2; Termination: SMD/SMT; Military Standard: Not; Max Power Dissipation: 100mW; Voltage Rating (DC): 50V; Length: 1mm; Height: 0.35mm; Width: 0.02inch; Depth: 0.5mm; REACH SVHC: No SVHC; Lead Free: Lead Free; ComponentLink1URL: https://www.alliedelec.com/m/d/623f45ff1957d936ff56d46fd1c28cac.pdf; ComponentLink1Description: https://www.alliedelec.com/m/d/623f45ff1957d936ff56d46fd1c28cac.pdf; ComponentLink2URL: http://industrial.panasonic.com/www-data/pdf/AOA0000/AOA0000CE2.pdf; ComponentLink2Description: http://industrial.panasonic.com/www-data/pdf/AOA0000/AOA0000CE2.pdf; ComponentLink3URL: http://www.farnell.com/datasheets/1911175.pdf; ComponentLink3Description: http://www.farnell.com/datasheets/1911175.pdf; ComponentLink4URL: http://components.arrow.com/part/dataview/41791037S8289418N1386; ComponentLink4Description: http://components.arrow.com/part/dataview/41791037S8289418N1386; ComponentLink5URL: http://www.mouser.com/ds/2/315/AOA0000CE2-37512.pdf; ComponentLink5Description: http://www.mouser.com/ds/2/315/AOA0000CE2-37512.pdf; ComponentLink6URL: http://www.farnell.com/datasheets/1694929.pdf; ComponentLink6Description: http://www.farnell.com/datasheets/1694929.pdf; Supplier Part Number 1: P300LCT-ND
U1 U3 = NCP551SN30T1G: LDO 3.0V 150mA CMOS w/Enable; Manufacturer: ON Semiconductor; Max Input Voltage: 12V; Min Input Voltage: 0uV; Dropout Voltage: 40mV; Output Voltage: 3V; Number of Outputs: 1; Input Bias Current: 4uA; Quiescent Current: 8uA; Accuracy: 2%; Polarity: Positive; Output Type: Fixed; Supplier 1: Digi-Key; Manufacturer Part Number: NCP551SN30T1G; Stock 1: 9920; Pricing 1: 1=0.54, 10=0.46, 100=0.3432, 500=0.2697, 1000=0.2084 (USD); Mount: Surface Mount; Case/Package: TSOP; Number of Pins: 5; Contact Plating: Matte,Tin; Min Operating Temperature: -40°C; Max Operating Temperature: 85°C; Max Output Current: 150mA; Package Quantity: 1; Packaging: Tape and Reel; Output Current: 150mA; Number of Regulators: 1; Min Output Voltage: 3V; Nominal Output Voltage: 3V; Output Voltage Accuracy: 2%; Length: 3mm; Height: 1mm; Width: 1.5mm; Radiation Hardening: No; REACH SVHC: No SVHC; Lead Free: Lead Free; Halogen Free: Halogen Free; ComponentLink1URL: http://www.onsemi.ru.com/pub/Collateral/NCP551-D.PDF; ComponentLink1Description: http://www.onsemi.ru.com/pub/Collateral/NCP551-D.PDF; ComponentLink2URL: http://www.onsemi.com/pub/Collateral/NCP551-D.PDF; ComponentLink2Description: http://www.onsemi.com/pub/Collateral/NCP551-D.PDF; Supplier Part Number 1: NCP551SN30T1GOSCT-ND
U2 = MCP3912A1-E/SS: IC Analog Front End - AFE 4 Chnl Energy Meter Front End 3V SPI/2; Manufacturer: Microchip; Interface: Serial,SPI; Number of Channels: 4; Resolution: 24b; Sampling Rate: 125KS/s; Max Supply Voltage: 3.6V; Min Supply Voltage: 2.7V; Supplier 1: Digi-Key; Manufacturer Part Number: MCP3912A1-E/SS; Stock 1: 156; Pricing 1: 1=3.33, 25=2.7708, 100=2.5235 (USD); Mount: Surface Mount; Case/Package: SSOP; Number of Pins: 28; Min Operating Temperature: -40°C; Max Operating Temperature: 125°C; Packaging: Rail/Tube; Package Quantity: 47; Number of A/D Converters: 4; Length: 10.5mm; Height: 1.85mm; Width: 5.6mm; REACH SVHC: No SVHC; Lead Free: Lead Free; Supplier Part Number 1: MCP3912A1-E/SS-ND
U4 U6 U9 U12 = AD8237ARMZ-R7: IC OPAMP INSTR 200KHZ RRO 8MSOP; Manufacturer: Analog Devices; Number of Channels: 1; Common Mode Rejection Ratio: 106dB; Max Supply Voltage: 5.5V; Min Supply Voltage: 1.8V; Slew Rate: 0.15V/µs; Nominal Supply Current: 115uA; Bandwidth: 20kHz; Input Bias Current: 250pA; Input Offset Voltage (Vos): 75uV; Output Current per Channel: 4mA; Voltage Gain: 60dB; Supplier 1: Digi-Key; Manufacturer Part Number: AD8237ARMZ-R7; Stock 1: 16545; Pricing 1: 1=2.76, 10=2.476, 100=2.0286, 500=1.7269 (USD); Mount: Surface Mount; Case/Package: MSOP; Number of Pins: 8; Contact Plating: Matte,Tin; Min Operating Temperature: -40°C; Max Operating Temperature: 125°C; Packaging: Tape and Reel; Package Quantity: 1; -3db Bandwidth: 200kHz; Number of Circuits: 1; Operating Supply Current: 115uA; Number of Elements: 1; Lead Free: Contains Lead; ComponentLink1URL: http://www.analog.com/media/en/technical-documentation/data-sheets/AD8237.pdf; ComponentLink1Description: http://www.analog.com/media/en/technical-documentation/data-sheets/AD8237.pdf; ComponentLink2URL: http://www.analog.com/static/imported-files/data_sheets/AD8237.pdf; ComponentLink2Description: http://www.analog.com/static/imported-files/data_sheets/AD8237.pdf; Supplier Part Number 1: AD8237ARMZ-R7CT-ND
U5 = LM7332MAX/NOPB: IC OP AMP R-R I/O DUAL 30V 8SOIC; Manufacturer: TI National Semiconductor; Slew Rate: 15.2V/µs; Unity Gain Bandwidth Product: 19.3MHz; Common Mode Rejection Ratio: 62dB; Max Supply Voltage: 32V; Min Supply Voltage: 2.5V; Min Dual Supply Voltage: 1.25V; Max Dual Supply Voltage: 16V; Number of Channels: 2; Output Current: 70mA; Nominal Supply Current: 2mA; Voltage Gain: 77dB; Input Offset Voltage (Vos): 2mV; Input Bias Current: 1uA; Gain Bandwidth Product: 21MHz; Power Supply Rejection Ratio (PSRR): 78dB; Supplier 1: Digi-Key; Manufacturer Part Number: LM7332MAX/NOPB; Stock 1: 7321; Pricing 1: 1=2.67, 10=2.402, 100=1.9306, 500=1.5862, 1000=1.3143 (USD); Mount: Surface Mount; Case/Package: SOIC; Number of Pins: 8; Contact Plating: Tin; Min Operating Temperature: -40°C; Max Operating Temperature: 125°C; Packaging: Tape and Reel; Package Quantity: 2500; Number of Circuits: 2; Operating Supply Current: 2mA; Output Current per Channel: 70mA; Number of Elements: 2; Operating Supply Voltage: 16V; Radiation Hardening: No; Lead Free: Lead Free; ComponentLink1URL: http://www.ti.com/lit/ds/symlink/lm7332.pdf; ComponentLink1Description: http://www.ti.com/lit/ds/symlink/lm7332.pdf; Supplier Part Number 1: 296-35310-1-ND
U7 U8 U10 U11 U13 = MCP6V31T-E/OT: IC OPAMP ZRO-DRFT 300KHZ SOT23-5; Manufacturer: Microchip; Slew Rate: 0.13V/µs; Voltage Gain: 135dB; Number of Channels: 1; Max Supply Voltage: 5.5V; Common Mode Rejection Ratio: 120dB; Min Supply Voltage: 1.8V; Output Current: 21mA; Nominal Supply Current: 23uA; Input Offset Voltage (Vos): 8uV; Input Bias Current: 5pA; Supplier 1: Digi-Key; Manufacturer Part Number: MCP6V31T-E/OT; Stock 1: 12497; Pricing 1: 1=1.11, 25=0.9272, 100=0.8446 (USD); Case/Package: SOT-23; Number of Pins: 5; Min Operating Temperature: -40°C; Max Operating Temperature: 125°C; Bandwidth: 300kHz; Packaging: Tape and Reel; Unity Gain Bandwidth Product: 300kHz; Package Quantity: 3000; Gain Bandwidth Product: 300kHz; Operating Supply Current: 23uA; Number of Circuits: 1; Output Current per Channel: 21mA; Number of Amplifiers: 1; Number of Elements: 1; Power Supply Rejection Ratio (PSRR): 120dB; Length: 3.1mm; Height: 1.3mm; Width: 1.8mm; Radiation Hardening: No; REACH SVHC: No SVHC; Lead Free: Lead Free; ComponentLink1URL: http://ww1.microchip.com/downloads/en/DeviceDoc/25127A.pdf; ComponentLink1Description: http://ww1.microchip.com/downloads/en/DeviceDoc/25127A.pdf; ComponentLink2URL: https://www.distrelec.biz/Web/Downloads/_t/ds/MCP6V31_1U_eng_tds.pdf?mime=application%2Fpdf; ComponentLink2Description: https://www.distrelec.biz/Web/Downloads/_t/ds/MCP6V31_1U_eng_tds.pdf?mime=application%2Fpdf; ComponentLink3URL: https://www.verical.com/server-webapp/html/getDatasheet?partID=762349; ComponentLink3Description: https://www.verical.com/server-webapp/html/getDatasheet?partID=762349; ComponentLink4URL: http://ww1.microchip.com/downloads/jp/DeviceDoc/jp557758.pdf; ComponentLink4Description: http://ww1.microchip.com/downloads/jp/DeviceDoc/jp557758.pdf; ComponentLink5URL: http://www.microchip.com/mymicrochip/filehandler.aspx?ddocname=en557758; ComponentLink5Description: http://www.microchip.com/mymicrochip/filehandler.aspx?ddocname=en557758; ComponentLink6URL: http://www.farnell.com/datasheets/1599560.pdf; ComponentLink6Description: http://www.farnell.com/datasheets/1599560.pdf; Supplier Part Number 1: MCP6V31T-E/OTCT-ND
U14 = LM334MX/NOPB: IC CURRENT SOURCE 3% 8SOIC; Manufacturer: TI National Semiconductor; Forward Voltage: 1V; Max Input Voltage: 40V; Output Voltage: 20V; Min Supply Voltage: 800mV; Max Supply Current: 10mA; Accuracy: 6%; Forward Current: 5mA; Max Power Dissipation: 400mW; Number of Outputs: 1; Quiescent Current: 1uA; Reference Type: Adjustable; Output Type: Analog; Supplier 1: Digi-Key; Manufacturer Part Number: LM334MX/NOPB; Stock 1: 58254; Pricing 1: 1=0.9, 10=0.802, 100=0.6254, 500=0.5166, 1000=0.4079 (USD); Mount: Surface Mount; Case/Package: SOIC; Number of Pins: 8; Min Operating Temperature: -40°C; Max Operating Temperature: 85°C; Packaging: Tape and Reel; Min Input Voltage: 1V; Max Supply Voltage: 40V; Package Quantity: 2500; Output Current: 10mA; Radiation Hardening: No; REACH SVHC: No SVHC; Lead Free: Lead Free; ComponentLink1URL: https://www.verical.com/server-webapp/html/getDatasheet?partID=629166; ComponentLink1Description: https://www.verical.com/server-webapp/html/getDatasheet?partID=629166; ComponentLink2URL: http://www.ti.com/lit/ds/symlink/lm234.pdf; ComponentLink2Description: http://www.ti.com/lit/ds/symlink/lm234.pdf; ComponentLink3URL: http://www.ti.com/general/docs/lit/getliterature.tsp?genericPartNumber=LM334&&fileType=pdf; ComponentLink3Description: http://www.ti.com/general/docs/lit/getliterature.tsp?genericPartNumber=LM334&&fileType=pdf; ComponentLink4URL: http://www.farnell.com/datasheets/1883087.pdf; ComponentLink4Description: http://www.farnell.com/datasheets/1883087.pdf; Supplier Part Number 1: LM334MX/NOPBCT-ND
U15 = MCP4011-103E/SN: IC 10K Digital Potentiometer Single, 2 Wire, Serial,  20%, 1.8 V; Manufacturer: Microchip; Min Supply Voltage: 1.8V; Max Supply Voltage: 5.5V; Resistance: 10kR; Operating Supply Voltage: 5V; Nominal Supply Current: 45uA; Interface: 2-Wire,Serial; Number of Circuits: 1; Number of Taps: 64; Memory Type: Volatile; Temperature Coefficient: 150ppm/°C; Supplier 1: Digi-Key; Manufacturer Part Number: MCP4011-103E/SN; Stock 1: 1448; Pricing 1: 1=0.53, 25=0.4428, 100=0.4017 (USD); Mount: Surface Mount; Case/Package: SOIC; Number of Pins: 8; Contact Plating: Matte,Tin; Min Operating Temperature: -40°C; Max Operating Temperature: 125°C; Tolerance: 20%; Packaging: Rail/Tube; Package Quantity: 100; Taper: Linear; Number of Positions: 64; Number of Elements: 1; Max Supply Current: 45uA; Length: 5mm; Height: 1.55mm; Width: 3.99mm; Radiation Hardening: No; REACH SVHC: No SVHC; Lead Free: Lead Free; ComponentLink1URL: http://ww1.microchip.com/downloads/en/DeviceDoc/21978c.pdf; ComponentLink1Description: http://ww1.microchip.com/downloads/en/DeviceDoc/21978c.pdf; ComponentLink2URL: https://www.verical.com/server-webapp/html/getDatasheet?partID=431510; ComponentLink2Description: https://www.verical.com/server-webapp/html/getDatasheet?partID=431510; ComponentLink3URL: http://www.microchip.com/mymicrochip/filehandler.aspx?ddocname=en025230; ComponentLink3Description: http://www.microchip.com/mymicrochip/filehandler.aspx?ddocname=en025230; ComponentLink4URL: http://www.microchip.com/mymicrochip/filehandler.aspx?ddocname=en023833; ComponentLink4Description: http://www.microchip.com/mymicrochip/filehandler.aspx?ddocname=en023833; ComponentLink5URL: https://www.distrelec.biz/Web/Downloads/_t/ds/mcp4011_eng_tds.pdf?mime=application%2Fpdf; ComponentLink5Description: https://www.distrelec.biz/Web/Downloads/_t/ds/mcp4011_eng_tds.pdf?mime=application%2Fpdf; ComponentLink6URL: http://www.farnell.com/datasheets/130143.pdf; ComponentLink6Description: http://www.farnell.com/datasheets/130143.pdf; Supplier Part Number 1: MCP4011-103E/SN-ND
U16-U18 = TPD4E1U06DBVR: IC ESD Suppressor Diode Arrays 5.5V 6-Pin SOT-23 T/R; Manufacturer: Texas Instruments; Capacitance: 1pF; Direction: Unidirectional; Polarity: Bidirectional; Number of Bidirectional Channels: 4; Min Breakdown Voltage: 6.5V; Clamping Voltage: 15V; Peak Pulse Power: 45W; Power Line Protection: Yes; Leakage Current: 10nA; Test Current: 1mA; Peak Pulse Current: 3A; Interface: Ethernet,LVDS,USB; Supplier 1: Digi-Key; Manufacturer Part Number: TPD4E1U06DBVR; Stock 1: 155098; Pricing 1: 1=0.43, 10=0.346, 100=0.2353, 500=0.1765, 1000=0.1324 (USD); Mount: Surface Mount; Case/Package: SOT-23; Number of Pins: 6; Min Operating Temperature: -40°C; Max Operating Temperature: 125°C; Packaging: Tape and Reel; Package Quantity: 3000; Reverse Standoff Voltage: 5.5V; Number of Channels: 4; Breakdown Voltage: 6.5V; Termination: SMD/SMT; Operating Supply Voltage: 5.5V; Working Voltage: 5.5V; ESD Protection: Yes; Max Reverse Leakage Current: 10nA; Max Power Dissipation: 45W; Length: 3.05mm; Height: 1.3mm; Depth: 1.75mm; Width: 1.75mm; Radiation Hardening: No; REACH SVHC: No SVHC; Lead Free: Lead Free; ComponentLink1URL: https://www.verical.com/server-webapp/html/getDatasheet?partID=716791; ComponentLink1Description: https://www.verical.com/server-webapp/html/getDatasheet?partID=716791; ComponentLink2URL: http://www.ti.com/lit/ds/symlink/tpd4e1u06.pdf; ComponentLink2Description: http://www.ti.com/lit/ds/symlink/tpd4e1u06.pdf; Supplier Part Number 1: 296-35965-1-ND
XTAL = ABLS-4.000MHZ-B2-T: 4MHz ±20ppm Crystal 18pF 180 Ohm -20°C ~ 70°C  Surface Mount HC49/US; Manufacturer: Abracon; ESR (Equivalent Series Resistance): 180R; Frequency Stability: 50ppm; Supplier 1: Digi-Key; Manufacturer Part Number: ABLS-4.000MHZ-B2-T; Stock 1: 74308; Pricing 1: 1=0.28, 10=0.234, 50=0.2104, 100=0.187, 500=0.1777 (USD); Mount: Surface Mount; Case/Package: SMD/SMT; Number of Pins: 2; Min Operating Temperature: -20°C; Max Operating Temperature: 70°C; Package Quantity: 1000; Frequency: 4MHz; Frequency Tolerance: 20ppm; Load Capacitance: 18pF; Packaging: Tape and Reel; Tolerance: 20ppm; Termination: SMD/SMT; Series Resistance: 180R; Length: 11.4mm; Height: 0.165inch; Width: 0.185inch; Depth: 4.7mm; Radiation Hardening: No; REACH SVHC: Yes; Lead Free: Lead Free; ComponentLink1URL: https://abracon.com/Support/PackageDrawing/Resonators/ABLS-2D.pdf; ComponentLink1Description: https://abracon.com/Support/PackageDrawing/Resonators/ABLS-2D.pdf; ComponentLink2URL: http://www.abracon.com/Resonators/abls.pdf; ComponentLink2Description: http://www.abracon.com/Resonators/abls.pdf; ComponentLink3URL: https://www.verical.com/server-webapp/html/getDatasheet?partID=722412; ComponentLink3Description: https://www.verical.com/server-webapp/html/getDatasheet?partID=722412; ComponentLink4URL: http://www.mouser.com/ds/2/3/abls-44621.pdf; ComponentLink4Description: http://www.mouser.com/ds/2/3/abls-44621.pdf; Supplier Part Number 1: 535-9085-1-ND